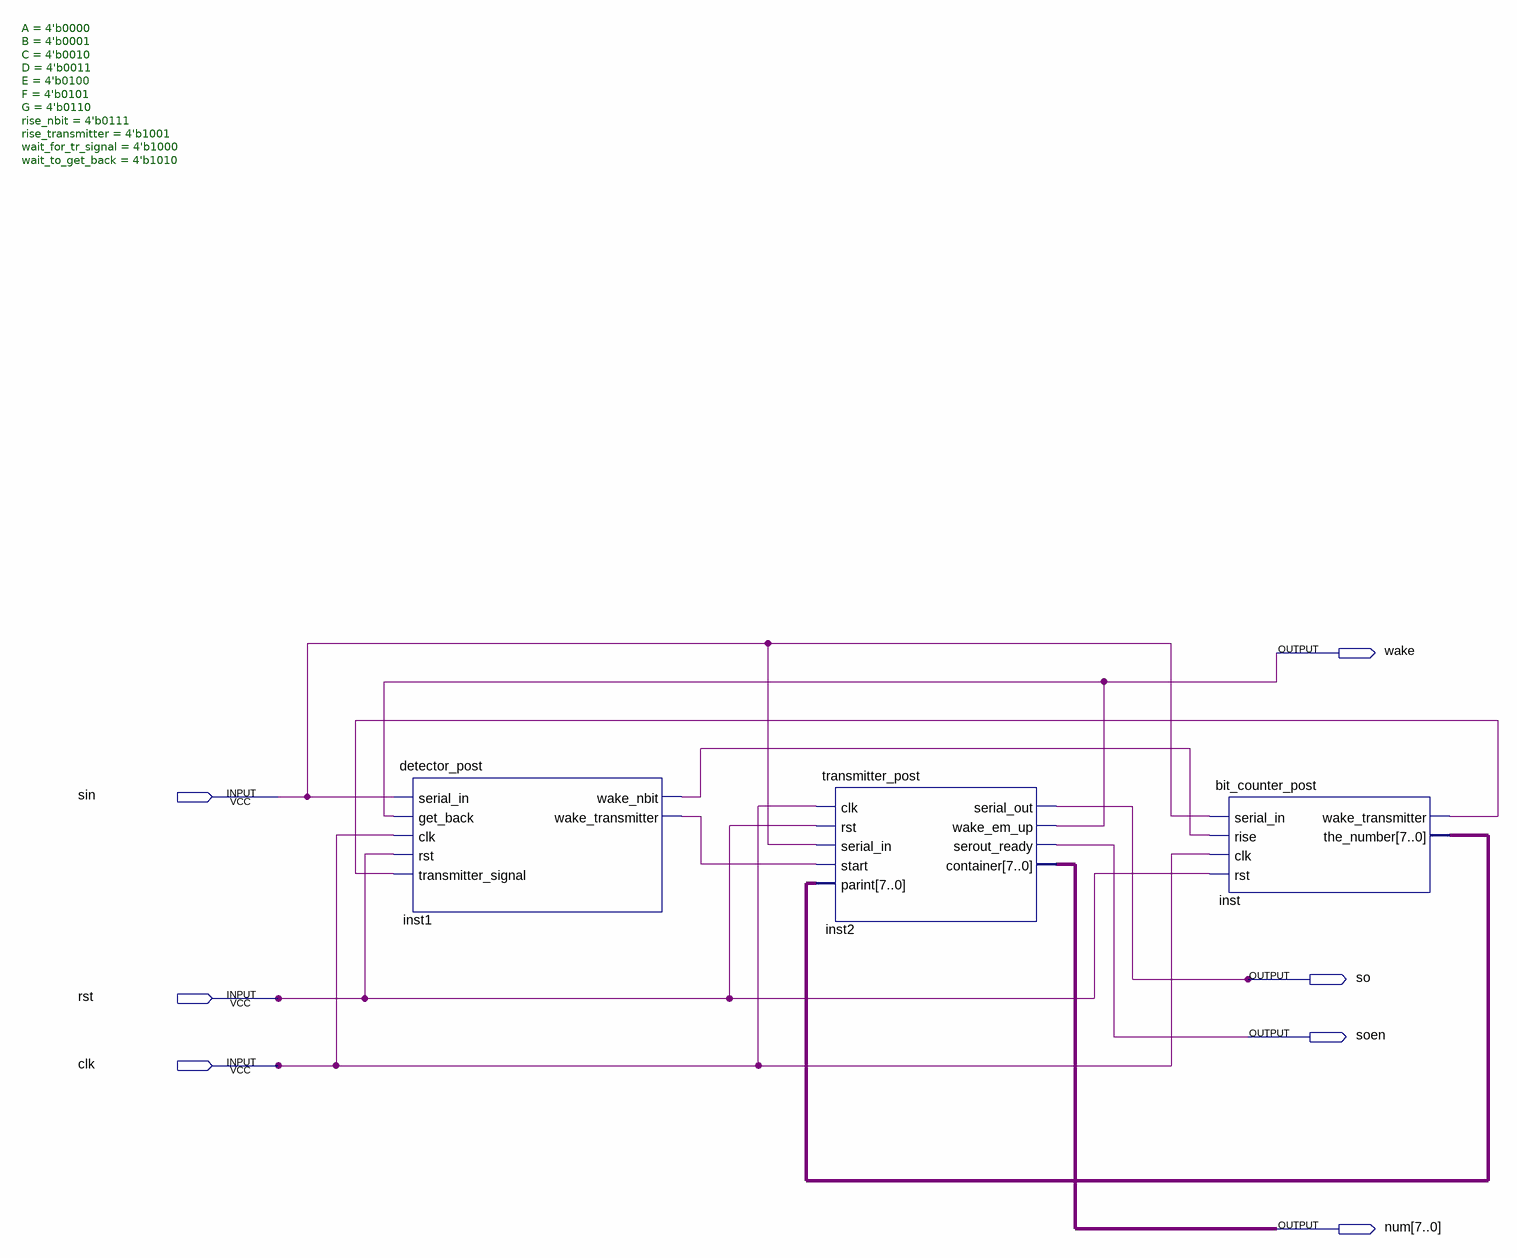
[diagram p0: schematic sheet]
// Quartus schematic circuit_d.bdf as structural Verilog: 3 symbols, 7 pins
module circuit_d (
  input  sin,
  input  rst,
  input  clk,
  output wake,
  output so,
  output soen,
  output [7:0] num
);

  wire inst1_wake_nbit, inst1_wake_transmitter, inst_wake_transmitter;
  wire [7:0] inst_the_number;

  detector_post #(.A(4'b0000), .B(4'b0001), .C(4'b0010), .D(4'b0011), .E(4'b0100), .F(4'b0101), .G(4'b0110), .rise_nbit(4'b0111), .rise_transmitter(4'b1001), .wait_for_tr_signal(4'b1000), .wait_to_get_back(4'b1010)) inst1 (
    .serial_in(sin), .get_back(wake), .clk(clk), .rst(rst), .transmitter_signal(inst_wake_transmitter),
    .wake_nbit(inst1_wake_nbit), .wake_transmitter(inst1_wake_transmitter));
  transmitter_post inst2 (
    .clk(clk), .rst(rst), .serial_in(sin), .start(inst1_wake_transmitter), .parint(inst_the_number),
    .serial_out(so), .wake_em_up(wake), .serout_ready(soen), .container(num));
  bit_counter_post inst (
    .serial_in(sin), .rise(inst1_wake_nbit), .clk(clk), .rst(rst), .wake_transmitter(inst_wake_transmitter),
    .the_number(inst_the_number));
endmodule
